# Altium schematic sheet Structural_scheme.SchDoc
size A3; Organization: Altium Limited; Address1: L3, 12a Rodborough Rd; Address2: Frenchs Forest; Address3: NSW; Address4: Australia 2086
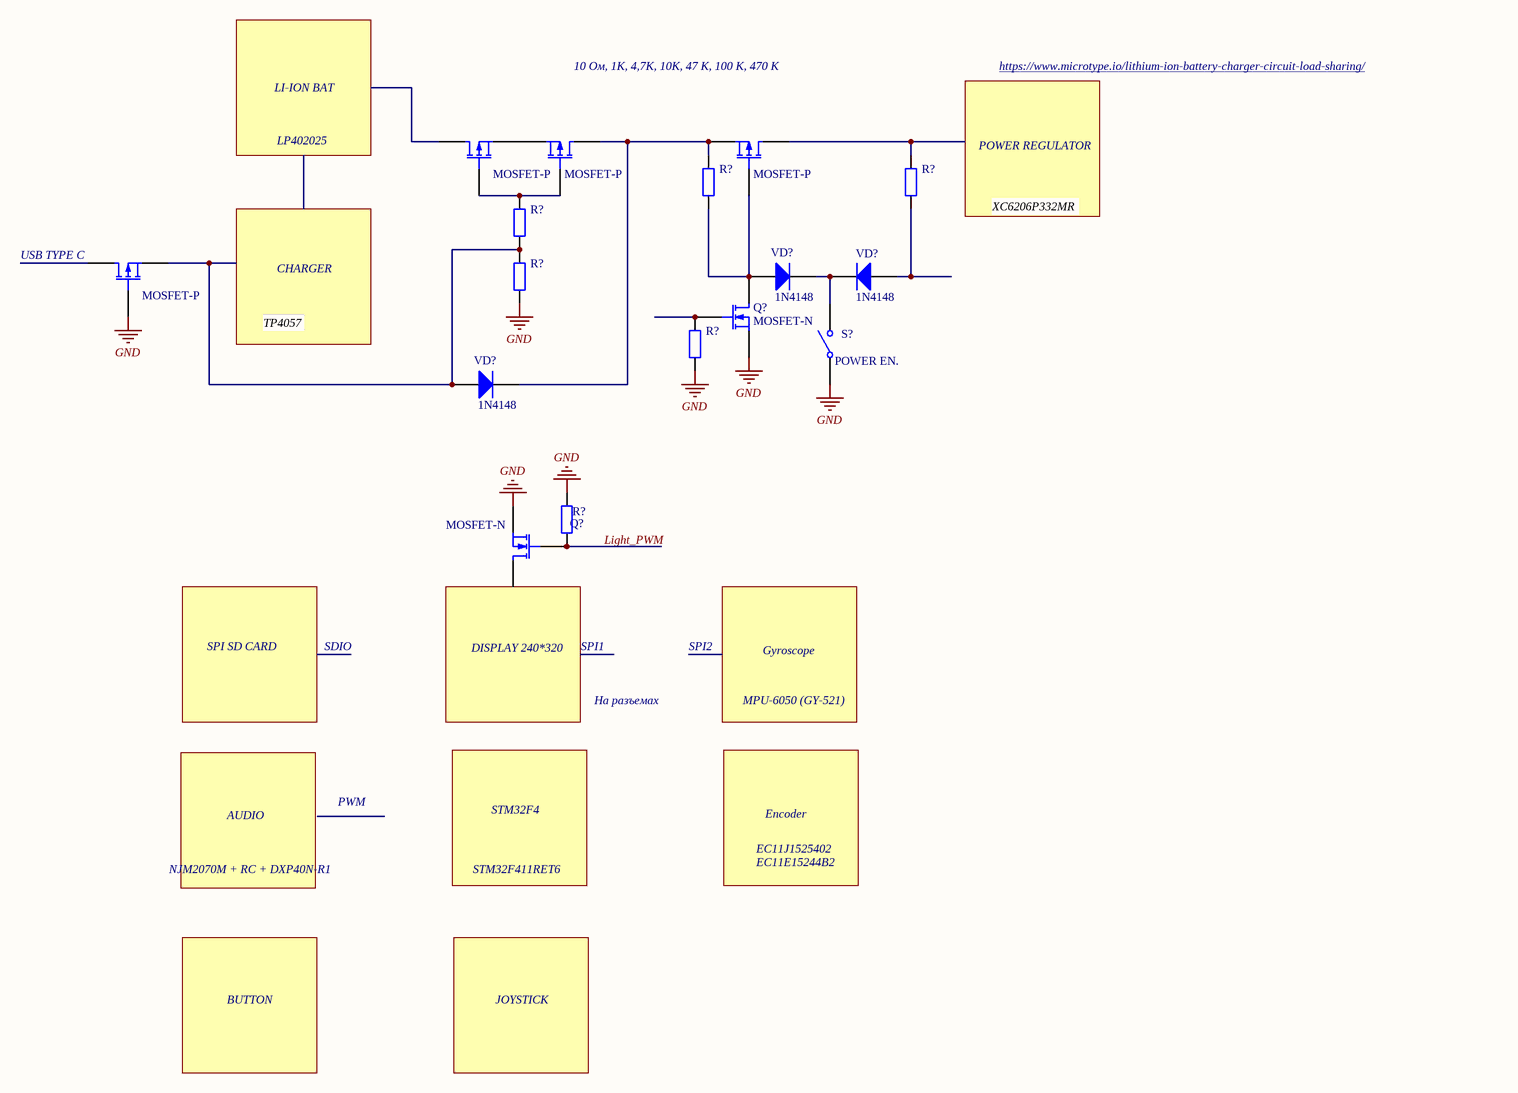
[diagram p0: Structural_scheme.SchDoc]

## Parts
(Parts that share a designator on the sheet are numbered #1, #2 ... from top to bottom, then left to right.)
Q?#1  MOSFET-P  [E3]
Q?#2  MOSFET-P  [E3]
Q?#3  MOSFET-P  [E3]
Q?#4  MOSFET-P  [E3]
Q?#5  MOSFET-N  [E3]
Q?#6  MOSFET-N  [E3]
R?#1  4.7K  [AXIAL-0.4]  (value not drawn)
R?#2  4.7K  [AXIAL-0.4]  (value not drawn)
R?#3  4.7K  [AXIAL-0.4]  (value not drawn)
R?#4  4.7K  [AXIAL-0.4]  (value not drawn)
R?#5  4.7K  [AXIAL-0.4]  (value not drawn)
R?#6  4.7K  [AXIAL-0.4]  (value not drawn)
S?  POWER EN.  [SPST-2]
VD?#1  1N4148  [DO-35]
VD?#2  1N4148  [DO-35]
VD?#3  1N4148  [DO-35]

## Nets
GND: Q?#4.2(G) Q?#5.3(S) Q?#6.3(S) R?#4.1 R?#5.1 R?#6.1 S?.1(COMMON)
NetQ?#1_2: Q?#1.2(G) Q?#2.2(G) R?#3.2
NetQ?#1_3: Q?#1.3(S) Q?#2.3(S)
NetQ?#2_1: Q?#2.1(D) Q?#3.3(S) R?#1.2 VD?#3.2(K)
NetQ?#3_1: Q?#3.1(D) R?#2.2
NetQ?#3_2: Q?#3.2(G) Q?#5.1(D) R?#1.1 VD?#1.1(A)
NetQ?#4_3: Q?#4.3(S) R?#3.1 R?#4.2 VD?#3.1(A)
NetQ?#5_2: Q?#5.2(G) R?#5.2
NetQ?#6_2: Q?#6.2(G) R?#6.2
NetR?#2_1: R?#2.1 VD?#2.1(A)
NetS?_2: S?.2(NO) VD?#1.2(K) VD?#2.2(K)

Not connected (* = marked no-connect by the designer): Q?#1 1(D); Q?#4 1(D); Q?#6 1(D)

## Notes on the sheet
- 10 Ом, 1K, 4,7K, 10K, 47 K, 100 K, 470 K
- https://www.microtype.io/lithium-ion-battery-charger-circuit-load-sharing/
- LI-ION BAT
- LP402025
- POWER REGULATOR
- XC6206P332MR
- (near Q?#4) USB TYPE C
- CHARGER
- TP4057
- SPI SD CARD
- SDIO
- DISPLAY 240*320
- SPI1
- SPI2
- Gyroscope
- На разъемах
- MPU-6050 (GY-521)
- AUDIO
- PWM
- STM32F4
- Encoder
- NJM2070M + RC + DXP40N-R1
- STM32F411RET6
- EC11J1525402
- EC11E15244B2
- BUTTON
- JOYSTICK
- Labels drawn without touching a wire or pin: Light_PWM
- Title
- Size:
- Date:
- A3
- Number:
- Time:
- Revision:
- Sheet
- of
- File:

## Library data of the parts
Q?#1-Q?#4 = MOSFET-P: P-Channel MOSFET; Published: 8-Jun-2000; LatestRevisionDate: 17-Jul-2002; LatestRevisionNote: Re-released for DXP Platform.; PackageVersion: 1995/1996; PackageReference: E3; Publisher: Altium Limited; PackageDescription: TO, Flat Index; 3 In-Line, Axial Leads; Body Dia. 4.6mm; Lead Dia. 0.5 mm (max)
Q?#5 Q?#6 = MOSFET-N: N-Channel MOSFET; Published: 8-Jun-2000; LatestRevisionDate: 17-Jul-2002; LatestRevisionNote: Re-released for DXP Platform.; PackageVersion: 1995/1996; PackageReference: E3; Publisher: Altium Limited; PackageDescription: TO, Flat Index; 3 In-Line, Axial Leads; Body Dia. 4.6mm; Lead Dia. 0.5 mm (max)
R?#1-R?#6 = Res2: Resistor; Published: 8-Jun-2000; LatestRevisionDate: 17-Jul-2002; LatestRevisionNote: Re-released for DXP Platform.; PackageReference: AXIAL-0.4; Publisher: Altium Limited; PackageDescription: Axial Device, Thru-Hole; 2 Leads; 0.4 in Pin Spacing
S? = SW-SPST: Single-Pole, Single-Throw Switch; Published: 24-Mar-1999; LatestRevisionDate: 17-Jul-2002; LatestRevisionNote: Re-released for DXP Platform.; PackageReference: SPST-2; Publisher: Altium Limited; PackageDescription: Switch; 2 Leads
VD?#1-VD?#3 = Diode 1N4148: High Conductance Fast Diode; Published: 8-Jun-2000; LatestRevisionDate: 17-Jul-2002; LatestRevisionNote: Re-released for DXP Platform.; DatasheetVersion: 1997; PackageReference: DO-35; Publisher: Altium Limited; PackageDescription: Diode, Axial; Body 3.8 x 1.9 mm (LxDia. max), Lead Dia. 0.53 mm (max); Code_JEDEC: DO-204-AH; ComponentLink1Description: Manufacturer Link; ComponentLink1URL: http://www.fairchildsemi.com/; ComponentLink2Description: Datasheet; ComponentLink2URL: http://www.fairchildsemi.com/ds/1N%2F1N4148.pdf